# EAGLE design UCirKitUserStudy3 (EAGLE 7.3.0)
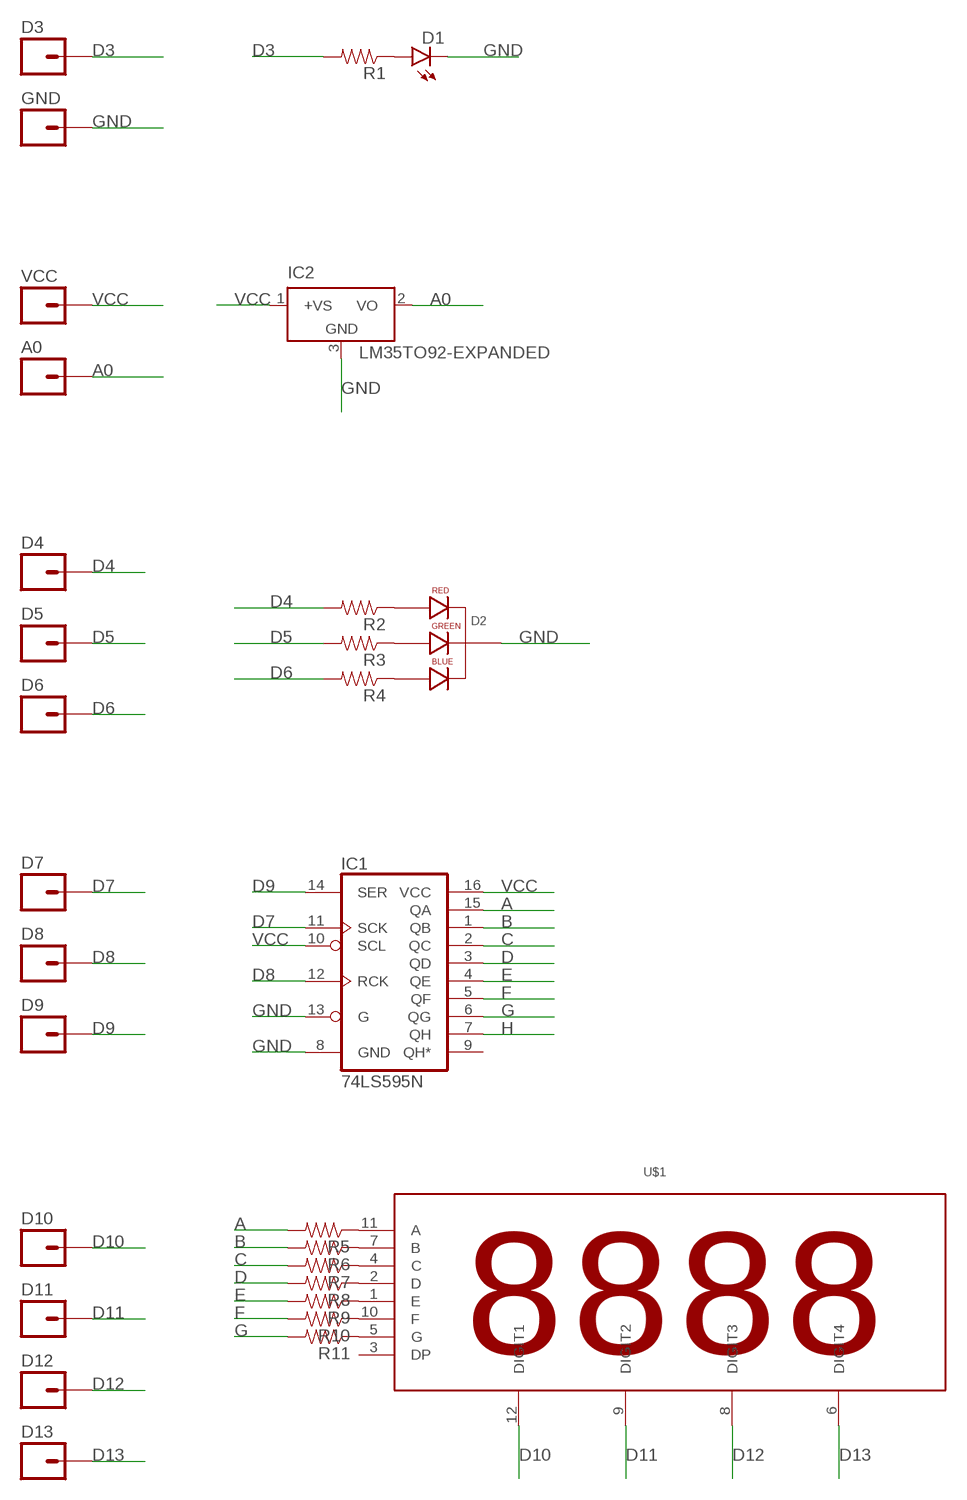
[diagram p0: schematic, sheet 1]

## Parts
A0  M01PTH  [1X01]
D1  LEDLED3MM-EXPANDED  [LED3MM-EXPANDED]
D2  LED-RGB-CC-THRUEXPANDED  [LED-RGB-THRU-EXPANDED]
D3  M01PTH  [1X01]
D4  M01PTH  [1X01]
D5  M01PTH  [1X01]
D6  M01PTH  [1X01]
D7  M01PTH  [1X01]
D8  M01PTH  [1X01]
D9  M01PTH  [1X01]
D10  M01PTH  [1X01]
D11  M01PTH  [1X01]
D12  M01PTH  [1X01]
D13  M01PTH  [1X01]
GND  M01PTH  [1X01]
IC1  74LS595N  [DIL16]
IC2  LM35TO92-EXPANDED  [TO92-EXPANDED]
R1  1KOHM-1/4W-1%(PTH)PTH-EXPANDED  [PTH-EXPANDED]
R2  1KOHM-1/4W-1%(PTH)PTH-EXPANDED  [PTH-EXPANDED]
R3  1KOHM-1/4W-1%(PTH)PTH-EXPANDED  [PTH-EXPANDED]
R4  1KOHM-1/4W-1%(PTH)PTH-EXPANDED  [PTH-EXPANDED]
R5  1KOHM-1/4W-1%(PTH)PTH-EXPANDED  [PTH-EXPANDED]
R6  1KOHM-1/4W-1%(PTH)PTH-EXPANDED  [PTH-EXPANDED]
R7  1KOHM-1/4W-1%(PTH)PTH-EXPANDED  [PTH-EXPANDED]
R8  1KOHM-1/4W-1%(PTH)PTH-EXPANDED  [PTH-EXPANDED]
R9  1KOHM-1/4W-1%(PTH)PTH-EXPANDED  [PTH-EXPANDED]
R10  1KOHM-1/4W-1%(PTH)PTH-EXPANDED  [PTH-EXPANDED]
R11  1KOHM-1/4W-1%(PTH)PTH-EXPANDED  [PTH-EXPANDED]
U$1  4DIGIT_SEVEN_SEGMENT4DIGIT_SEVEN_SEGMENT  [4DIGIT_SEVEN_SEGMENT]
VCC  M01PTH  [1X01]

## Nets
A: IC1.15(QA) R5.P$2
A0: A0.1 IC2.2(VO)
B: IC1.1(QB) R6.P$2
C: IC1.2(QC) R7.P$2
D: IC1.3(QD) R8.P$2
D3: D3.1 R1.P$2
D4: D4.1 R2.P$2
D5: D5.1 R3.P$2
D6: D6.1 R4.P$2
D7: D7.1 IC1.11(SCK)
D8: D8.1 IC1.12(RCK)
D9: D9.1 IC1.14(SER)
D10: D10.1 U$1.12(DIGIT1)
D11: D11.1 U$1.9(DIGIT2)
D12: D12.1 U$1.8(DIGIT3)
D13: D13.1 U$1.6(DIGIT4)
E: IC1.4(QE) R9.P$2
F: IC1.5(QF) R10.P$2
G: IC1.6(QG) R11.P$2
GND: D1.K(C) D2.2(CATHODE) GND.1 IC1.8(GND) IC1.13(G) IC2.3(GND)
H: IC1.7(QH)
N$1: D1.A R1.P$1
N$2: D2.1(RED_CATHODE) R2.P$1
N$3: D2.3(GREEN_CATHODE) R3.P$1
N$4: D2.4(BLUE_CATHODE) R4.P$1
N$5: R5.P$1 U$1.11(A)
N$6: R6.P$1 U$1.7(B)
N$7: R7.P$1 U$1.4(C)
N$8: R8.P$1 U$1.2(D)
N$9: R9.P$1 U$1.1(E)
N$10: R10.P$1 U$1.10(F)
N$11: R11.P$1 U$1.5(G)
VCC: IC1.10(SCL) IC1.16(VCC) IC2.1(+VS) VCC.1
Unconnected: IC1.9(QH*) U$1.3(DP)

## Library data of the parts
A0 D3-D13 GND VCC = SparkFun-Connectors:M01: Header 1 Standard 1-pin 0.1" header. Use with straight break away headers (SKU : PRT-00116), right angle break away headers (PRT-00553), swiss pins (PRT-00743), machine pins (PRT-00117), and female headers (PRT-00115).
D1 = SparkFun-LED:LED: LEDs Standard schematic elements and footprints for 5mm, 3mm, 1206, and 0603 sized LEDs. 5mm - Spark Fun Electronics SKU : COM-00529 (and others)
D2 = SparkFun-LED:LED-RGB-CC-THRU: RGB Through-hole common cathode LED SparkFun Storefront: COM-00105 (Clear) COM-09264 (Diffuse)
IC1 = SparkFun-DigitalIC:74*595: 8-bit SHIFT REGISTER, output latch
IC2 = lm35:LM35: Single-Supply Centigrade Temperature Sensor Vout = (10mV/°C x Temp °C) +5mmmV Source: http://www.national.com/ds/LM/LM35.pdf
R1-R11 = SparkFun-Resistors:1KOHM-1/4W-1%(PTH): RES-12182
U$1 = led-7-segment:4DIGIT_SEVEN_SEGMENT

## Board
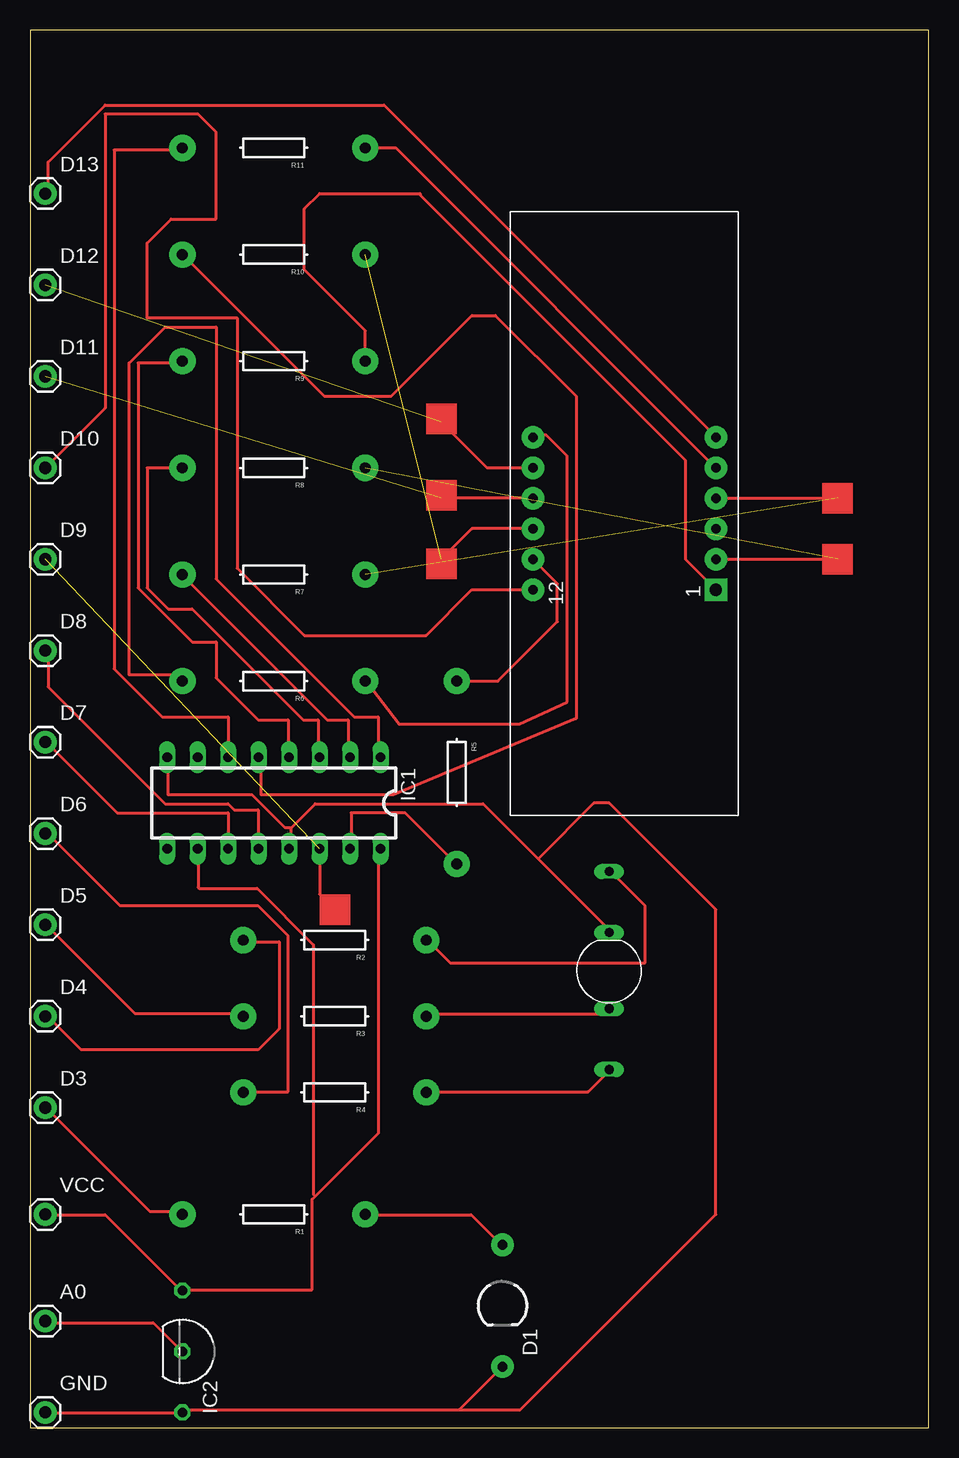
[diagram p1: board, top side]

Size 74.91 x 116.51 mm. Coordinates in mm from the lower left corner, seen from the top.
Outline: 0,0 74.91,0 74.91,116.51 0,116.51 0,0
Copper layers (1*16): Top 0.035mm / dielectric 1.5mm / Bottom 0.035mm
Design rules "default *": minimum track width 10mil, minimum drill 24mil, track to track 10mil, track to pad 60mil, pad to pad 9mil, via to via 9mil, smd to smd 8mil, copper to edge 40mil, drill to drill 8mil, minimum pad ring 10mil, minimum via ring 8mil, stop-mask expansion 4mil, vias tented up to drill 0mil, thermal gap 10mil

### Footprints (pad centres in the part's own frame; a part is rotated, then mirrored left to right if it is on the bottom)
1X01 = drill 1.016 pad 1.88: 1 0,0
LED3MM-EXPANDED = drill 0.813 pad 1.88: A -5.08,0; K 5.08,0
LED-RGB-THRU-EXPANDED = drill 0.762 pad 0.889 long: 1 8.255,0; 2 3.175,0; 3 -3.175,0; 4 -8.255,0
DIL16 = drill 0.813 long: 1 -8.89,-3.81; 2 -6.35,-3.81; 3 -3.81,-3.81; 4 -1.27,-3.81; 5 1.27,-3.81; 6 3.81,-3.81; 7 6.35,-3.81; 8 8.89,-3.81; 9 8.89,3.81; 10 6.35,3.81; 11 3.81,3.81; 12 1.27,3.81; 13 -1.27,3.81; 14 -3.81,3.81; 15 -6.35,3.81; 16 -8.89,3.81
TO92-EXPANDED = drill 0.813 octagon: 1 -5.08,0; 2 0,0; 3 5.08,0
PTH-EXPANDED = drill 0.9 pad 2.184: P$1 -7.62,0; P$2 7.62,0
4DIGIT_SEVEN_SEGMENT = drill 1.016 pad 1.88 square: 1 -6.35,-7.62 | drill 0.8 pad 1.88: 2 -3.81,-7.62; 3 -1.27,-7.62; 4 1.27,-7.62; 5 3.81,-7.62; 6 6.35,-7.62; 7 6.35,7.62; 8 3.81,7.62; 9 1.27,7.62; 10 -1.27,7.62; 11 -3.81,7.62; 12 -6.35,7.62

### Placement (x,y rotation side)
A0  1.27,8.89 0 top
D1  39.37,10.16 270 top
D2  48.26,38.1 90 top
D3  1.27,26.67 0 top
D4  1.27,34.29 0 top
D5  1.27,41.91 0 top
D6  1.27,49.53 0 top
D7  1.27,57.15 0 top
D8  1.27,64.77 0 top
D9  1.27,72.39 0 top
D10  1.27,80.01 0 top
D11  1.27,87.63 0 top
D12  1.27,95.25 0 top
D13  1.27,102.87 0 top
GND  1.27,1.27 0 top
IC1  20.32,52.07 180 top
IC2  12.7,6.35 270 top
R1  20.32,17.78 180 top
R2  25.4,40.64 180 top
R3  25.4,34.29 180 top
R4  25.4,27.94 180 top
R5  35.56,54.61 270 top
R6  20.32,62.23 180 top
R7  20.32,71.12 180 top
R8  20.32,80.01 180 top
R9  20.32,88.9 180 top
R10  20.32,97.79 180 top
R11  20.32,106.68 180 top
U$1  49.53,76.2 90 top
VCC  1.27,17.78 0 top

### Tracks (layer width: path | path; a pad name or v marks a point on that pad's centre or on a via)
A
  Top 0.254: IC1.15 26.75,48.5 26.75,51.25 31.25,51.25 35.5,47 R5.P$2
A0
  Top 0.254: IC2.2 12.5,6.5 10.25,8.75 1.5,8.75 A0.1
B
  Top 0.254: IC1.1 29,56 29,59.25 27,59.25 15.5,70.75 15.5,91.75 11.25,91.75 8.25,88.75 8.25,62.75 12,62.75 12.5,62.25 R6.P$2
C
  Top 0.254: IC1.2 26.5,56 26.5,59 24.75,59 12.75,71 R7.P$2
D
  Top 0.254: IC1.3 24,56 24,59 22.75,59 13.5,68.25 11.5,68.25 9.75,70 9.75,80 12.5,80 R8.P$2
D3
  Top 0.254: D3.1 1.5,26.5 10,18 12.5,18 R1.P$2
D4
  Top 0.254: D4.1 1.5,34.25 4.25,31.5 19,31.5 20.75,33.25 20.75,40.5 18,40.5 R2.P$2
D5
  Top 0.254: D5.1 1.5,41.75 8.75,34.5 17.75,34.5 R3.P$2
D6
  Top 0.254: D6.1 1.5,49.5 7.5,43.5 19,43.5 21.5,41 21.5,28 18,28 R4.P$2
D7
  Top 0.254: IC1.11 16.5,48.5 16.5,51.25 7.25,51.25 1.5,57 D7.1
D8
  Top 0.254: IC1.12 19,48.5 19,51.5 17,51.5 16.5,52 11.25,52 1.5,61.75 1.5,64.75 D8.1
D9  (1 unrouted)
  Top 0.254: IC1.14 24.13,44.45 25.4,43.18
D10
  Top 0.254: D10.1 1.5,80.25 6.25,85 6.25,109.5 14,109.5 15.5,108 15.5,100.75 11.75,100.75 9.75,98.75 9.75,92.5 17.25,92.5 17.25,71.65 22.86,66.04 33.02,66.04 36.83,69.85 U$1.12 41.75,69.75
D11  (1 unrouted)
  Top 0.254: U$1.9 34.29,77.47
D12  (1 unrouted)
  Top 0.254: U$1.8 38.1,80.01 34.29,83.82
D13
  Top 0.254: U$1.6 57,82.75 29.5,110.25 6.25,110.25 1.5,105.5 1.5,103 D13.1
E
  Top 0.254: IC1.4 21.5,56 21.5,59 19,59 15.5,62.5 15.5,65.5 13.5,65.5 9,70 9,88.75 12.5,88.75 R9.P$2
F
  Top 0.254: IC1.5 19.25,55.75 19.25,52.75 30.25,52.75 45.5,59.11 45.5,86 38.79,92.71 36.83,92.71 30.12,86 24.5,86 12.75,97.75 R10.P$2
G
  Top 0.254: IC1.6 16.5,56 16.5,59.25 11,59.25 7,63.25 7,106.5 12.5,106.5 R11.P$2
GND
  Top 0.254: GND.1 1.5,1.25 12.5,1.25 IC2.3 12.75,1.5 35.75,1.5 | 35.75,1.5 39.25,5 D1.K | 42.34,47.41 37.75,52 23.75,52 21.75,50 | 42.34,47.41 48.25,41.5 D2.2 | 21.75,50 21.75,48.5 IC1.13 | 21.75,50 21.25,50 18.5,52.75 11.5,52.75 11.5,55.75 IC1.8 | 35.75,1.5 40.87,1.5 57.15,17.78 57.15,43.18 48.26,52.07 46.99,52.07 42.34,47.41
N$1
  Top 0.254: D1.A 39.25,15.25 36.75,17.75 28,17.75 R1.P$1
N$2
  Top 0.254: D2.1 48.5,46.25 51.25,43.5 51.25,38.75 35,38.75 33.25,40.5 R2.P$1
N$3
  Top 0.254: D2.3 48.25,34.75 48,34.5 33.25,34.5 R3.P$1
N$4
  Top 0.254: D2.4 48.25,29.75 46.5,28 33.25,28 R4.P$1
N$5
  Top 0.254: R5.P$1 38.99,62.23 43.94,67.18 43.94,70.36 U$1.11
N$6
  Top 0.254: U$1.7 42,82.75 43,82.75 44.75,81 44.75,68 44.77,60.51 40.75,58.65 30.75,58.65 28,62.25 R6.P$1
N$7  (1 unrouted)
  Top 0.254: U$1.4 67.31,77.47
N$8  (1 unrouted)
  Top 0.254: U$1.2 67.31,72.39
N$9
  Top 0.254: R9.P$1 27.94,91.44 22.86,96.52 22.86,101.6 24.13,102.87 32.51,102.87 32.51,102.74 54.61,80.64 54.61,72.39 U$1.1
N$10  (1 unrouted)
  Top 0.254: U$1.10 36.83,74.93 34.29,72.39
N$11
  Top 0.254: R11.P$1 30.48,106.68 U$1.5
VCC
  Top 0.254: IC1.10 14,48.25 14,45.05 14.1,44.96 18.92,44.96 23.62,40.26 23.62,19.43 23.76,19.29 | IC1.16 29,48.25 29,24.53 23.76,19.29 | VCC.1 1.5,17.75 6.25,17.75 12.5,11.5 IC2.1 12.75,11.5 23.52,11.5 23.52,19.05 23.76,19.29
(copper drawn outside any net)
  shapes: Top area x6